# Altium project A13-OLinuXino-MICRO_Rev_B_saved.PrjPcb
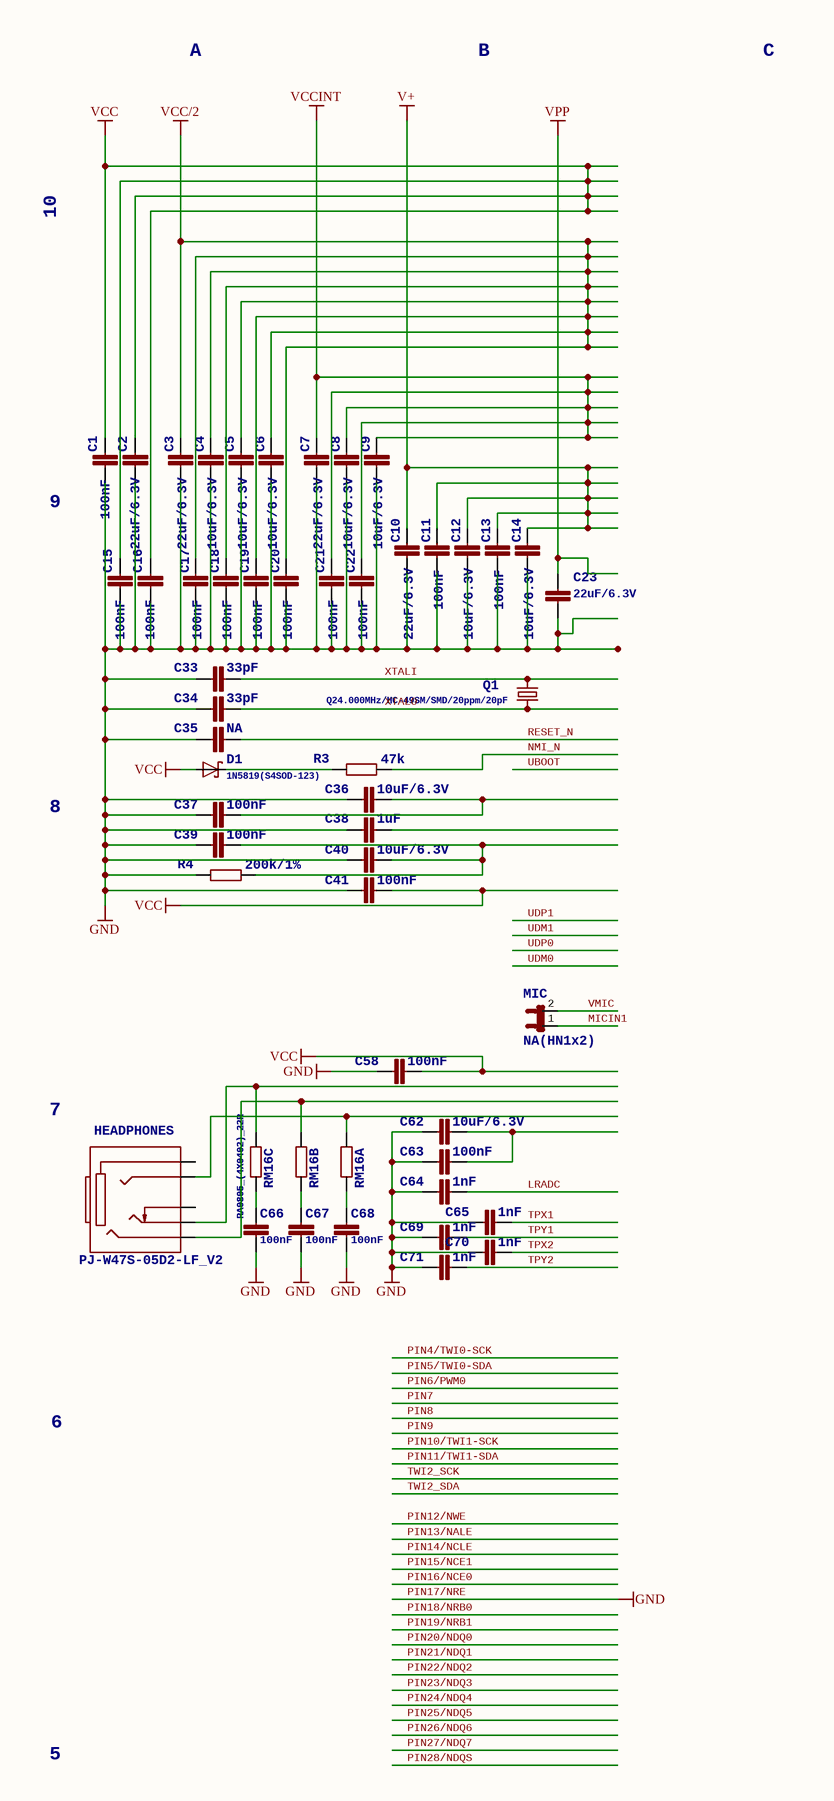
[diagram p0: A13-OLinuXino-MICRO_Rev_B_saved.SchDoc, top left]
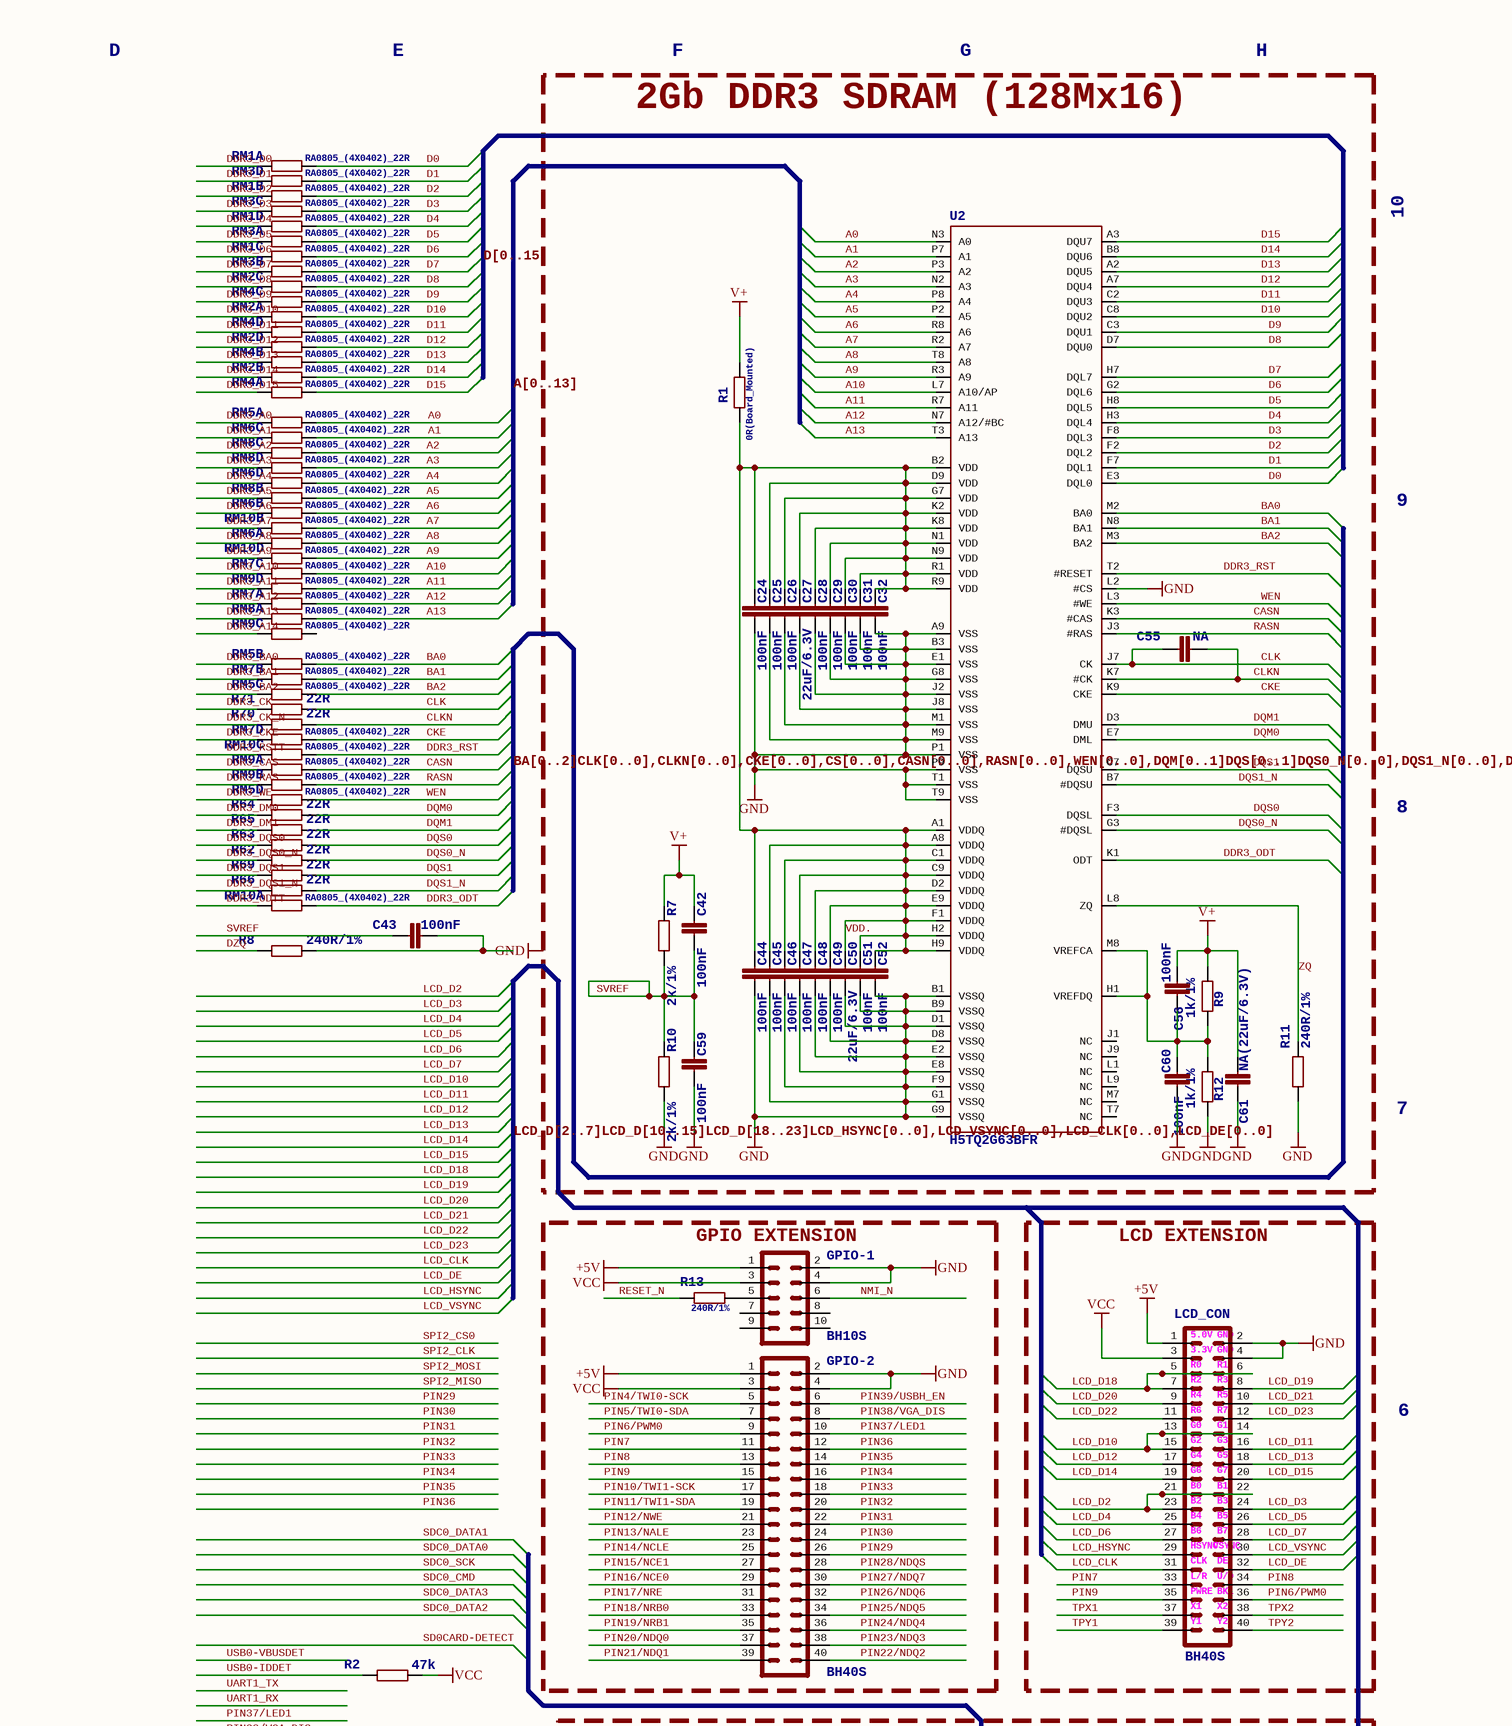
[diagram p1: A13-OLinuXino-MICRO_Rev_B_saved.SchDoc, top right]
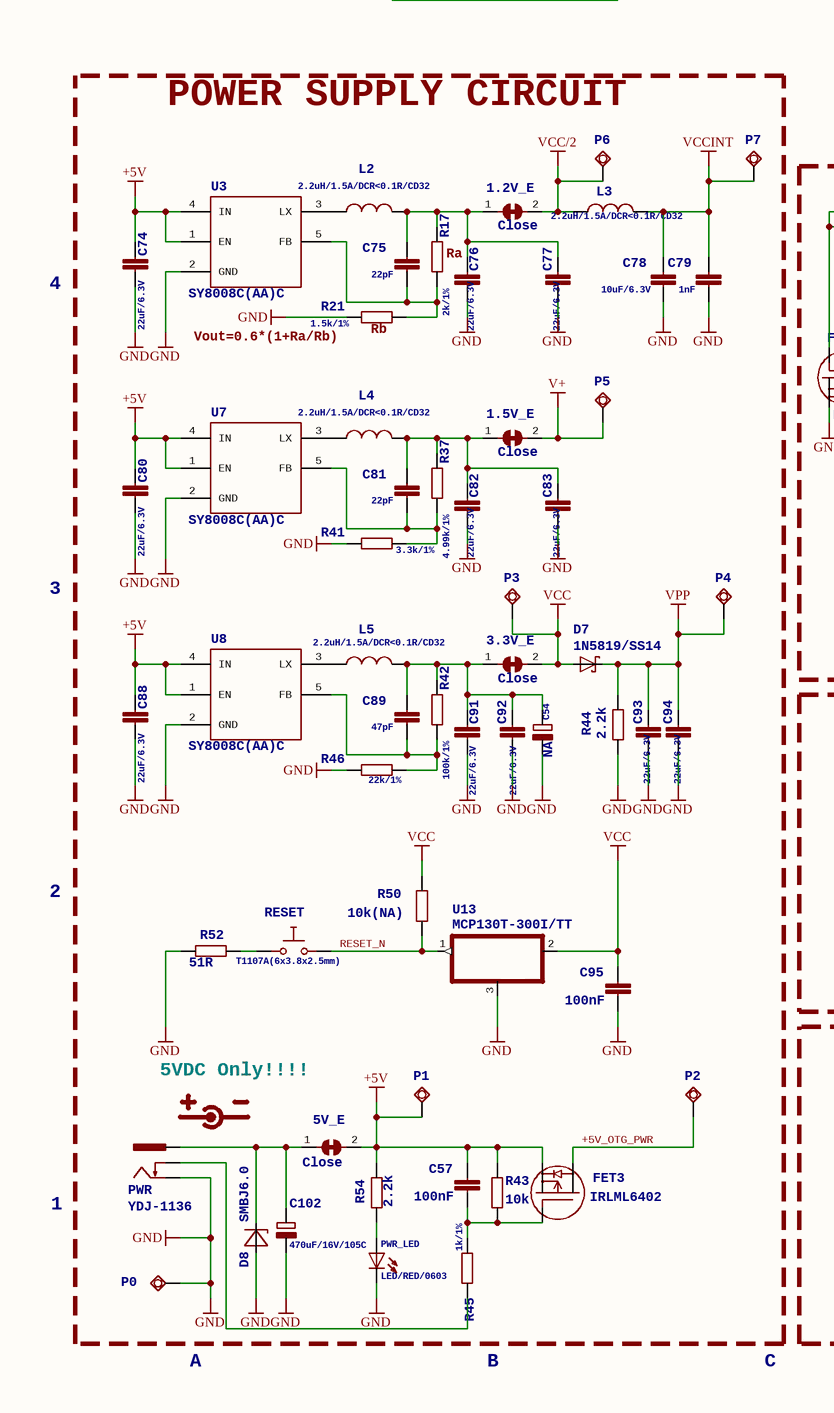
[diagram p2: A13-OLinuXino-MICRO_Rev_B_saved.SchDoc, bottom left]
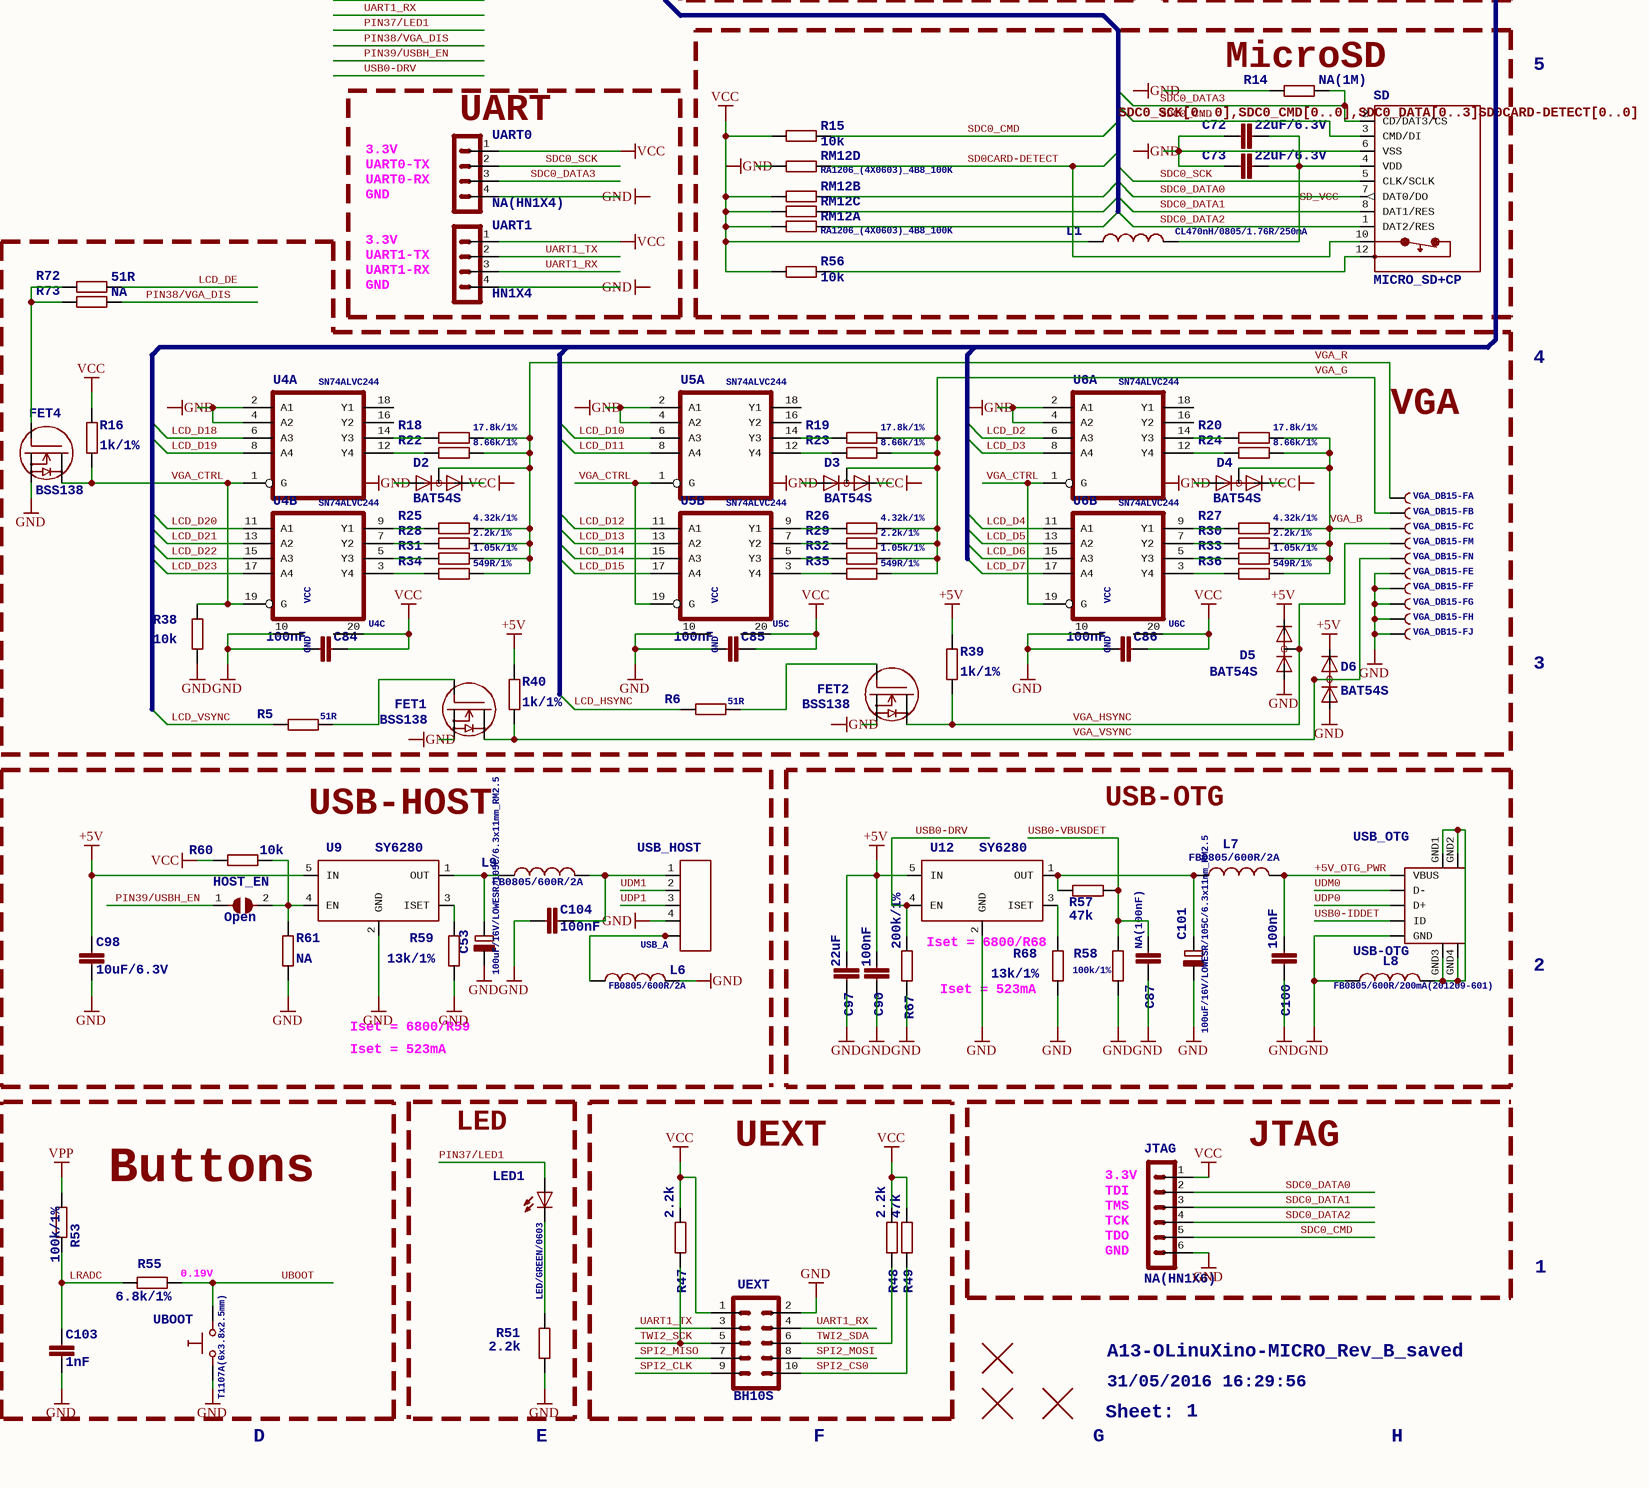
[diagram p3: A13-OLinuXino-MICRO_Rev_B_saved.SchDoc, bottom right]
1 sheet, 253 parts. Net scope: global (net labels, ports and power ports of the same name join across sheets).
Board file: A13-OLinuXino-MICRO_Rev_B_saved.PcbDoc

## Sheet A13-OLinuXino-MICRO_Rev_B_saved.SchDoc: A13-OLinuXino-MICRO_Rev_B_saved
size 409 x 542 mm; Date: 31/05/2016 16:29:56; SheetNumber: 1

### Parts
1.2V_E  Close  [SJ_1_SMALLER_CLOSE]
1.5V_E  Close  [SJ_1_SMALLER_CLOSE]
3.3V_E  Close  [SJ_1_SMALLER_CLOSE]
5V_E  Close  [SJ_1_SMALLER_CLOSE]
C1  100nF  [C0603_DWS]
C2  22uF/6.3V  [C0603_DWS]
C3  22uF/6.3V  [C0603_DWS]
C4  10uF/6.3V  [C0603_DWS]
C5  10uF/6.3V  [C0603_DWS]
C6  10uF/6.3V  [C0603_DWS]
C7  22uF/6.3V  [C0603_DWS]
C8  10uF/6.3V  [C0603_DWS]
C9  10uF/6.3V  [C0603_DWS]
C10  22uF/6.3V  [C0603_DWS]
C11  100nF  [C0603_DWS]
C12  10uF/6.3V  [C0603_DWS]
C13  100nF  [C0603_DWS]
C14  10uF/6.3V  [C0603_DWS]
C15  100nF  [C0603_DWS]
C16  100nF  [C0603_DWS]
C17  100nF  [C0603_DWS]
C18  100nF  [C0603_DWS]
C19  100nF  [C0603_DWS]
C20  100nF  [C0603_DWS]
C21  100nF  [C0603_DWS]
C22  100nF  [C0603_DWS]
C23  22uF/6.3V  [C0603_DWS]
C24  100nF  [C0603_DWS]
C25  100nF  [C0603_DWS]
C26  100nF  [C0603_DWS]
C27  22uF/6.3V  [C0603_DWS]
C28  100nF  [C0603_DWS]
C29  100nF  [C0603_DWS]
C30  100nF  [C0603_DWS]
C31  100nF  [C0603_DWS]
C32  100nF  [C0603_DWS]
C33  33pF  [C0603_DWS]
C34  33pF  [C0603_DWS]
C35  NA  [C0603_DWS]
C36  10uF/6.3V  [C0603_DWS]
C37  100nF  [C0603_DWS]
C38  1uF  [C0603_DWS]
C39  100nF  [C0603_DWS]
C40  10uF/6.3V  [C0603_DWS]
C41  100nF  [C0603_DWS]
C42  100nF  [C0603_DWS]
C43  100nF  [C0603_DWS]
C44  100nF  [C0603_DWS]
C45  100nF  [C0603_DWS]
C46  100nF  [C0603_DWS]
C47  100nF  [C0603_DWS]
C48  100nF  [C0603_DWS]
C49  100nF  [C0603_DWS]
C50  22uF/6.3V  [C0603_DWS]
C51  100nF  [C0603_DWS]
C52  100nF  [C0603_DWS]
C53  100uF/16V/LOWESR/105C/6.3x11mm_RM2.5  [E2,5-6,3]
C54  NA  [E3,5-8]
C55  NA  [C0603_DWS]
C56  100nF  [C0603_DWS]
C57  100nF  [C0603_DWS]
C58  100nF  [C0603_DWS]
C59  100nF  [C0603_DWS]
C60  100nF  [C0603_DWS]
C61  NA(22uF/6.3V)  [C0603_DWS]
C62  10uF/6.3V  [C0603_DWS]
C63  100nF  [C0603_DWS]
C64  1nF  [C0603_DWS]
C65  1nF  [C0603_DWS]
C66  100nF  [C0603_DWS]
C67  100nF  [C0603_DWS]
C68  100nF  [C0603_DWS]
C69  1nF  [C0603_DWS]
C70  1nF  [C0603_DWS]
C71  1nF  [C0603_DWS]
C72  22uF/6.3V  [C0603_DWS]
C73  22uF/6.3V  [C0603_DWS]
C74  22uF/6.3V  [C0603_DWS]
C75  22pF  [C0603_DWS]
C76  22uF/6.3V  [C0603_DWS]
C77  22uF/6.3V  [C0603_DWS]
C78  10uF/6.3V  [C0603_DWS]
C79  1nF  [C0603_DWS]
C80  22uF/6.3V  [C0603_DWS]
C81  22pF  [C0603_DWS]
C82  22uF/6.3V  [C0603_DWS]
C83  22uF/6.3V  [C0603_DWS]
C84  100nF  [C0603_DWS]
C85  100nF  [C0603_DWS]
C86  100nF  [C0603_DWS]
C87  NA(100nF)  [C0603_DWS]
C88  22uF/6.3V  [C0603_DWS]
C89  47pF  [C0603_DWS]
C90  100nF  [C0603_DWS]
C91  22uF/6.3V  [C0603_DWS]
C92  22uF/6.3V  [C0603_DWS]
C93  22uF/6.3V  [C0603_DWS]
C94  22uF/6.3V  [C0603_DWS]
C95  100nF  [C0603_DWS]
C97  22uF  [C0603_DWS]
C98  10uF/6.3V  [C0603_DWS]
C100  100nF  [C0603_DWS]
C101  100uF/16V/LOWESR/105C/6.3x11mm_RM2.5  [E2,5-6,3]
C102  470uF/16V/105C  [E3,5-8]
C103  1nF  [C0603_DWS]
C104  100nF  [C0603_DWS]
D1  1N5819(S4SOD-123)  [SOD-123]
D2  BAT54S  [SOT23C(BAT54S)]
D3  BAT54S  [SOT23C(BAT54S)]
D4  BAT54S  [SOT23C(BAT54S)]
D5  BAT54S  [SOT23C(BAT54S)]
D6  BAT54S  [SOT23C(BAT54S)]
D7  1N5819/SS14  [MLL-41]
D8  SMBJ6.0  [DO214AA]
FET1  BSS138  [SOT23]
FET2  BSS138  [SOT23]
FET3  IRLML6402  [SOT23]
FET4  BSS138  [SOT23]
GPIO-1  BH10S  [ML10-MALE]
GPIO-2  BH40S  [ML40]
HEADPHONES  PJ-W47S-05D2-LF_V2  [PJ-W47S-05D2-LF_5PIN_V2]
HOST_EN  Open  [SJ_1_SMALLER]
JTAG  NA(HN1X6)  [HN1X6]
L1  CL470nH/0805/1.76R/250mA  [L0805_5MIL_DWS]
L2  2.2uH/1.5A/DCR<0.1R/CD32  [CD32]
L3  2.2uH/1.5A/DCR<0.1R/CD32  [CD32]
L4  2.2uH/1.5A/DCR<0.1R/CD32  [CD32]
L5  2.2uH/1.5A/DCR<0.1R/CD32  [CD32]
L6  FB0805/600R/2A  [L0805_5MIL_DWS]
L7  FB0805/600R/2A  [L0805_5MIL_DWS]
L8  FB0805/600R/200mA(201209-601)  [L0805_5MIL_DWS]
L9  FB0805/600R/2A  [L0805_5MIL_DWS]
LCD_CON  BH40S  [ML40]
LED1  LED/GREEN/0603  [LED-0603]
MIC  NA(HN1x2)  [JP1]
P0  TESTPADTESTPAD_40-ROUND  [TESTPAD_40-ROUND]  (value not drawn)
P1  TESTPADTESTPAD_40-ROUND  [TESTPAD_40-ROUND]  (value not drawn)
P2  TESTPADTESTPAD_40-ROUND  [TESTPAD_40-ROUND]  (value not drawn)
P3  TESTPADTESTPAD_40-ROUND  [TESTPAD_40-ROUND]  (value not drawn)
P4  TESTPADTESTPAD_40-ROUND  [TESTPAD_40-ROUND]  (value not drawn)
P5  TESTPADTESTPAD_40-ROUND  [TESTPAD_40-ROUND]  (value not drawn)
P6  TESTPADTESTPAD_40-ROUND  [TESTPAD_40-ROUND]  (value not drawn)
P7  TESTPADTESTPAD_40-ROUND  [TESTPAD_40-ROUND]  (value not drawn)
PWR  YDJ-1136  [PWR_JACK_UNI_MILLING]
PWR_LED  LED/RED/0603  [LED-0603]
Q1  Q24.000MHz/HC-49SM/SMD/20ppm/20pF  [HC49/SMD2_THIN]
R1  0R(Board_Mounted)  [0603_0R]
R2  47k  [R0603_5MIL_DWS]
R3  47k  [R0603_5MIL_DWS]
R4  200k/1%  [R0603_5MIL_DWS]
R5  51R  [R0603_5MIL_DWS]
R6  51R  [R0603_5MIL_DWS]
R7  2k/1%  [R0603_5MIL_DWS]
R8  240R/1%  [R0603_5MIL_DWS]
R9  1k/1%  [R0603_5MIL_DWS]
R10  2k/1%  [R0603_5MIL_DWS]
R11  240R/1%  [R0603_5MIL_DWS]
R12  1k/1%  [R0603_5MIL_DWS]
R13  240R/1%  [R0603_5MIL_DWS]
R14  NA(1M)  [R0603_5MIL_DWS]
R15  10k  [R0603_5MIL_DWS]
R16  1k/1%  [R0603_5MIL_DWS]
R17  2k/1%  [R0603_5MIL_DWS]
R18  17.8k/1%  [R0603_5MIL_DWS]
R19  17.8k/1%  [R0603_5MIL_DWS]
R20  17.8k/1%  [R0603_5MIL_DWS]
R21  1.5k/1%  [R0603_5MIL_DWS]
R22  8.66k/1%  [R0603_5MIL_DWS]
R23  8.66k/1%  [R0603_5MIL_DWS]
R24  8.66k/1%  [R0603_5MIL_DWS]
R25  4.32k/1%  [R0603_5MIL_DWS]
R26  4.32k/1%  [R0603_5MIL_DWS]
R27  4.32k/1%  [R0603_5MIL_DWS]
R28  2.2k/1%  [R0603_5MIL_DWS]
R29  2.2k/1%  [R0603_5MIL_DWS]
R30  2.2k/1%  [R0603_5MIL_DWS]
R31  1.05k/1%  [R0603_5MIL_DWS]
R32  1.05k/1%  [R0603_5MIL_DWS]
R33  1.05k/1%  [R0603_5MIL_DWS]
R34  549R/1%  [R0603_5MIL_DWS]
R35  549R/1%  [R0603_5MIL_DWS]
R36  549R/1%  [R0603_5MIL_DWS]
R37  4.99k/1%  [R0603_5MIL_DWS]
R38  10k  [R0603_5MIL_DWS]
R39  1k/1%  [R0603_5MIL_DWS]
R40  1k/1%  [R0603_5MIL_DWS]
R41  3.3k/1%  [R0603_5MIL_DWS]
R42  100k/1%  [R0603_5MIL_DWS]
R43  10k  [R0603_5MIL_DWS]
R44  2.2k  [R0603_5MIL_DWS]
R45  1k/1%  [R0603_5MIL_DWS]
R46  22k/1%  [R0603_5MIL_DWS]
R47  2.2k  [R0603_5MIL_DWS]
R48  2.2k  [R0603_5MIL_DWS]
R49  47k  [R0603_5MIL_DWS]
R50  10k(NA)  [R0603_5MIL_DWS]
R51  2.2k  [R0603_5MIL_DWS]
R52  51R  [R0603_5MIL_DWS]
R53  100k/1%  [R0603_5MIL_DWS]
R54  2.2k  [R0603_5MIL_DWS]
R55  6.8k/1%  [R0603_5MIL_DWS]
R56  10k  [R0603_5MIL_DWS]
R57  47k  [R0603_5MIL_DWS]
R58  100k/1%  [R0603_5MIL_DWS]
R59  13k/1%  [R0603_5MIL_DWS]
R60  10k  [R0603_5MIL_DWS]
R61  NA  [R0603_5MIL_DWS]
R62  22R  [R0603_5MIL_DWS]
R63  22R  [R0603_5MIL_DWS]
R64  22R  [R0603_5MIL_DWS]
R65  22R  [R0603_5MIL_DWS]
R66  22R  [R0603_5MIL_DWS]
R67  200k/1%  [R0603_5MIL_DWS]
R68  13k/1%  [R0603_5MIL_DWS]
R69  22R  [R0603_5MIL_DWS]
R70  22R  [R0603_5MIL_DWS]
R71  22R  [R0603_5MIL_DWS]
R72  51R  [R0603_5MIL_DWS]
R73  NA  [R0603_5MIL_DWS]
RESET  T1107A(6x3.8x2.5mm)  [SW-TAKT_6X3.5_SMD]
RM1  RA0805_(4X0402)_22R  [R_MATRIX_4_0402_25X625]  (parts A,B,C,D of 4)
RM2  RA0805_(4X0402)_22R  [R_MATRIX_4_0402_25X625]  (parts A,B,C,D of 4)
RM3  RA0805_(4X0402)_22R  [R_MATRIX_4_0402_25X625]  (parts A,B,C,D of 4)
RM4  RA0805_(4X0402)_22R  [R_MATRIX_4_0402_25X625]  (parts A,B,C,D of 4)
RM5  RA0805_(4X0402)_22R  [R_MATRIX_4_0402_25X625]  (parts A,B,C,D of 4)
RM6  RA0805_(4X0402)_22R  [R_MATRIX_4_0402_25X625]  (parts A,B,C,D of 4)
RM7  RA0805_(4X0402)_22R  [R_MATRIX_4_0402_25X625]  (parts A,B,C,D of 4)
RM8  RA0805_(4X0402)_22R  [R_MATRIX_4_0402_25X625]  (parts A,B,C,D of 4)
RM9  RA0805_(4X0402)_22R  [R_MATRIX_4_0402_25X625]  (parts A,B,C,D of 4)
RM10  RA0805_(4X0402)_22R  [R_MATRIX_4_0402_25X625]  (parts A,B,C,D of 4)
RM12  RA1206_(4X0603)_4B8_100K  [R_MATRIX_4]  (value not drawn)  (parts A,B,C,D of 4)
RM16  RA0805_(4X0402)_22R  [R_MATRIX_4_0402_25X625]  (parts A,B,C of 4)
SD  MICRO_SD+CP  [TFR-MEM-CON]
U2  H5TQ2G63BFR  [FBGA96]
U3  SY8008C(AA)C  [SOT23-5]
U4  SN74ALVC244  [PW]  (parts A,B,C of 3)
U5  SN74ALVC244  [PW]  (parts A,B,C of 3)
U6  SN74ALVC244  [PW]  (parts A,B,C of 3)
U7  SY8008C(AA)C  [SOT23-5]
U8  SY8008C(AA)C  [SOT23-5]
U9  SY6280  [SOT23-5]
U12  SY6280  [SOT23-5]
U13  MCP130T-300I/TT  [SOT23]
U$1  FIDUCIAL1X2  [FIDUCIAL-1X2]  (value not drawn)
U$2  FIDUCIAL1X2  [FIDUCIAL-1X2]  (value not drawn)
U$3  FIDUCIAL1X2  [FIDUCIAL-1X2]  (value not drawn)
UART0  NA(HN1X4)  [HN1X4]
UART1  HN1X4  [HN1X4]
UBOOT  T1107A(6x3.8x2.5mm)  [SW-TAKT_6X3.5_SMD]
UEXT  BH10S  [ML10-MALE]
USB_HOST  USB_A  [USB_PN87520_HOST_PTH]
USB_OTG  USB-OTG  [USB_MINI_9PIN]
VGA_DB15-F  VGA15  [DB15-F_22MM]  (value not drawn)  (parts A,B,C,E,F,G,H,J,M,N of 17)

### Blocks framed on the sheet
2Gb DDR3 SDRAM (128Mx16): C24-C32 C42 C44-C52 C55 C56 C59-C61 R1 R7 R9-R12 U2
GPIO EXTENSION: GPIO-1 GPIO-2 R13
LCD EXTENSION: LCD_CON
UART: UART0 UART1
MicroSD: C72 C73 L1 R14 R15 R56 RM12 SD
POWER SUPPLY CIRCUIT: 1.2V_E 1.5V_E 3.3V_E 5V_E C54 C57 C74-C83 C88 C89 C91-C95 C102 D7 D8 FET3 L2-L5 P0-P7 PWR PWR_LED R17 R21 R37 R41-R46 R50 R52 R54 RESET U3 U7 U8 U13
VGA: C84-C86 D2-D6 FET1 FET2 FET4 R5 R6 R16 R18-R20 R22-R36 R38-R40 R72 R73 U4-U6 VGA_DB15-F
USB-HOST: C53 C98 C104 HOST_EN L6 L9 R59-R61 U9 USB_HOST
USB-OTG: C87 C90 C97 C100 C101 L7 L8 R57 R58 R67 R68 U12 USB_OTG
Buttons: C103 R53 R55 UBOOT
LED: LED1 R51
UEXT: R47-R49 UEXT
JTAG: JTAG

### Nets
+5V: 5V_E.2 C57.1 C74.1 C80.1 C88.1 C90.1 C97.1 C98.1 D5.2(K) D6.2(K) FET3.2(S) GPIO-1.1 GPIO-2.1 LCD_CON.1 P1.1(PP) R39.2 R40.2 R43.2 R54.1 U3.1(EN) U3.4(IN) U7.1(EN) U7.4(IN) U8.1(EN) U8.4(IN) U9.5(IN) U12.5(IN)
PIN17/NRE: 3.3V_E.2 C1.1 C1.2 C2.1 C2.2 C3.1 C4.1 C5.1 C6.1 C7.1 C8.1 C9.1 C10.1 C11.1 C12.1 C13.1 C14.1 C15.1 C15.2 C16.1 C16.2 C17.1 C18.1 C19.1 C20.1 C21.1 C22.1 C23.1 C24.2 C25.2 C26.2 C27.2 C28.2 C29.2 C30.2 C31.2 C32.2 C33.1 C34.1 C35.1 C36.1 C37.1 C38.1 C39.1 C40.1 C41.1 C41.2 C44.2 C45.2 C46.2 C47.2 C48.2 C49.2 C50.2 C51.2 C52.2 C53.- C54.- C58.1 C58.2 C59.1 C60.1 C61.1 C62.1 C63.1 C64.1 C65.1 C66.1 C67.1 C68.1 C69.1 C70.1 C71.1 C74.2 C76.2 C77.2 C78.2 C79.2 C80.2 C82.2 C83.2 C84.1 C84.2 C85.1 C85.2 C86.1 C86.2 C87.2 C88.2 C90.2 C91.2 C92.2 C93.2 C94.2 C95.1 C95.2 C97.2 C98.2 C100.2 C101.- C102.- C103.2 C104.2 D1.A D5.1(A) D6.1(A) D7.A D8.A FET4.2(S) GPIO-1.2 GPIO-1.3 GPIO-1.4 GPIO-2.2 GPIO-2.3 GPIO-2.4 GPIO-2.31 JTAG.1 JTAG.6 L1.1 L6.1 L8.1 LCD_CON.2 LCD_CON.3 LCD_CON.4 P0.1(PP) P3.1(PP) PWR.- PWR_LED.C R2.1 R4.2 R10.1 R11.1 R12.1 R15.2 R16.2 R21.2 R38.1 R41.2 R44.2 R46.2 R47.2 R48.2 R49.2 R50.2 R51.1 R52.2 R56.2 R58.1 R59.1 R60.1 R61.1 R67.1 R68.1 RM12.1.2 RM12.2.2 RM12.3.2 U2.A9(VSS) U2.B1(VSSQ) U2.B3(VSS) U2.B9(VSSQ) U2.D1(VSSQ) U2.D8(VSSQ) U2.E1(VSS) U2.E2(VSSQ) U2.E8(VSSQ) U2.F9(VSSQ) U2.G1(VSSQ) U2.G8(VSS) U2.G9(VSSQ) U2.J2(VSS) U2.J8(VSS) U2.L2(#CS) U2.M1(VSS) U2.M9(VSS) U2.P1(VSS) U2.P9(VSS) U2.T1(VSS) U2.T9(VSS) U3.2(GND) U4.10(GND) U4.20(VCC) U5.10(GND) U5.20(VCC) U6.10(GND) U6.20(VCC) U7.2(GND) U8.2(GND) U9.2(GND) U12.2(GND) U13.2(VCC) U13.3(GND) UART0.1 UART1.1 UBOOT.P$1 UEXT.1 UEXT.2 USB_HOST.4 USB_OTG.GND VGA_DB15-F.5(F) VGA_DB15-F.6(F) VGA_DB15-F.7(F) VGA_DB15-F.8(F) VGA_DB15-F.10(F)  [also labelled GND, VCC]
V+: 1.5V_E.2 C10.2 C11.2 C12.2 C13.2 C14.2 C42.1 C56.1 C61.2 P5.1(PP) R1.1(1.1) R7.2 R9.2
VCC/2: 1.2V_E.2 C3.2 C4.2 C5.2 C6.2 C17.2 C18.2 C19.2 C20.2 L3.1 P6.1(PP)
VCCINT: C7.2 C8.2 C9.2 C21.2 C22.2 C78.1 C79.1 L3.2 P7.1(PP)
VPP: C23.2 C93.1 C94.1 D7.K(C) P4.1(PP) R44.1 R53.1
+5V_OTG_PWR: C100.1 FET3.3(D) L7.1 P2.1(PP) USB_OTG.VBUS
A0: RM5.1.2 U2.N3(A0)
A1: RM6.3.2 U2.P7(A1)
A2: RM8.3.2 U2.P3(A2)
A3: RM8.4.2 U2.N2(A3)
A4: RM6.4.2 U2.P8(A4)
A5: RM8.2.2 U2.P2(A5)
A6: RM6.2.2 U2.R8(A6)
A7: RM10.2.2 U2.R2(A7)
A8: RM6.1.2 U2.T8(A8)
A9: RM10.4.2 U2.R3(A9)
A10: RM7.3.2 U2.L7(A10/AP)
A11: RM9.4.2 U2.R7(A11)
A12: RM7.1.2 U2.N7(A12/#BC)
A13: RM8.1.2 U2.T3(A13)
BA0: RM5.2.2 U2.M2(BA0)
BA1: RM7.2.2 U2.N8(BA1)
BA2: RM5.3.2 U2.M3(BA2)
BA[0..2]CLK[0..0],CLKN[0..0],CKE[0..0],CS[0..0],CASN[0..0],RASN[0..0],WEN[0..0],DQM[0..1]DQS[0..1]DQS0_N[0..0],DQS1_N[0..0],DDR3_RST[0..0],DDR3_ODT[0..0]: RM9.2.2 U2.J3(#RAS)  [also labelled RASN]
CASN: RM9.1.2 U2.K3(#CAS)
CKE: RM7.4.2 U2.K9(CKE)
CLK: C55.1 R71.1 U2.J7(CK)
CLKN: C55.2 R70.1 U2.K7(#CK)
D0: RM1.1.2 U2.E3(DQL0)
D1: RM3.4.2 U2.F7(DQL1)
D2: RM1.2.2 U2.F2(DQL2)
D3: RM3.3.2 U2.F8(DQL3)
D4: RM1.4.2 U2.H3(DQL4)
D5: RM3.1.2 U2.H8(DQL5)
D6: RM1.3.2 U2.G2(DQL6)
D7: RM3.2.2 U2.H7(DQL7)
D8: RM2.3.2 U2.D7(DQU0)
D9: RM4.3.2 U2.C3(DQU1)
D10: RM2.1.2 U2.C8(DQU2)
D11: RM4.4.2 U2.C2(DQU3)
D12: RM2.4.2 U2.A7(DQU4)
D13: RM4.2.2 U2.A2(DQU5)
D14: RM2.2.2 U2.B8(DQU6)
D15: RM4.1.2 U2.A3(DQU7)
DDR3_A0: RM5.1.1
DDR3_A1: RM6.3.1
DDR3_A2: RM8.3.1
DDR3_A3: RM8.4.1
DDR3_A4: RM6.4.1
DDR3_A5: RM8.2.1
DDR3_A6: RM6.2.1
DDR3_A7: RM10.2.1
DDR3_A8: RM6.1.1
DDR3_A9: RM10.4.1
DDR3_A10: RM7.3.1
DDR3_A11: RM9.4.1
DDR3_A12: RM7.1.1
DDR3_A13: RM8.1.1
DDR3_A14: RM9.3.1
DDR3_BA0: RM5.2.1
DDR3_BA1: RM7.2.1
DDR3_BA2: RM5.3.1
DDR3_CAS: RM9.1.1
DDR3_CK: R71.2
DDR3_CK_N: R70.2
DDR3_CKE: RM7.4.1
DDR3_D0: RM1.1.1
DDR3_D1: RM3.4.1
DDR3_D2: RM1.2.1
DDR3_D3: RM3.3.1
DDR3_D4: RM1.4.1
DDR3_D5: RM3.1.1
DDR3_D6: RM1.3.1
DDR3_D7: RM3.2.1
DDR3_D8: RM2.3.1
DDR3_D9: RM4.3.1
DDR3_D10: RM2.1.1
DDR3_D11: RM4.4.1
DDR3_D12: RM2.4.1
DDR3_D13: RM4.2.1
DDR3_D14: RM2.2.1
DDR3_D15: RM4.1.1
DDR3_DM0: R64.2
DDR3_DM1: R65.2
DDR3_DQS0: R63.2
DDR3_DQS0_N: R62.2
DDR3_DQS1: R69.2
DDR3_DQS1_N: R66.2
DDR3_ODT: RM10.1.2 U2.K1(ODT)
DDR3_ODTT: RM10.1.1
DDR3_RAS: RM9.2.1
DDR3_RST: RM10.3.2 U2.T2(#RESET)
DDR3_RSTT: RM10.3.1
DDR3_WE: RM5.4.1
DQM0: R64.1 U2.E7(DML)
DQM1: R65.1 U2.D3(DMU)
DQS0: R63.1 U2.F3(DQSL)
DQS0_N: R62.1 U2.G3(#DQSL)
DQS1: R69.1 U2.C7(DQSU)
DQS1_N: R66.1 U2.B7(#DQSU)
DZQ: R8.2
LCD_CLK: LCD_CON.31
LCD_D2: LCD_CON.21 LCD_CON.22 LCD_CON.23 U6.6(A3)
LCD_D3: LCD_CON.24 U6.8(A4)
LCD_D4: LCD_CON.25 U6.11(A1)
LCD_D5: LCD_CON.26 U6.13(A2)
LCD_D6: LCD_CON.27 U6.15(A3)
LCD_D7: LCD_CON.28 U6.17(A4)
LCD_D10: LCD_CON.13 LCD_CON.14 LCD_CON.15 U5.6(A3)
LCD_D11: LCD_CON.16 U5.8(A4)
LCD_D12: LCD_CON.17 U5.11(A1)
LCD_D13: LCD_CON.18 U5.13(A2)
LCD_D14: LCD_CON.19 U5.15(A3)
LCD_D15: LCD_CON.20 U5.17(A4)
LCD_D18: LCD_CON.5 LCD_CON.6 LCD_CON.7 U4.6(A3)
LCD_D19: LCD_CON.8 U4.8(A4)
LCD_D20: LCD_CON.9 U4.11(A1)
LCD_D21: LCD_CON.10 U4.13(A2)
LCD_D22: LCD_CON.11 U4.15(A3)
LCD_D23: LCD_CON.12 U4.17(A4)
LCD_DE: LCD_CON.32 R72.2
LCD_HSYNC: LCD_CON.29 R6.1
LCD_VSYNC: LCD_CON.30 R5.1
LRADC: C64.2 C103.1 R53.2 R55.1
MICIN1: MIC.1
NMI_N: GPIO-1.6 R3.1
PIN4/TWI0-SCK: GPIO-2.5
PIN5/TWI0-SDA: GPIO-2.7
PIN6/PWM0: GPIO-2.9 LCD_CON.36
PIN7: GPIO-2.11 LCD_CON.33
PIN8: GPIO-2.13 LCD_CON.34
PIN9: GPIO-2.15 LCD_CON.35
PIN10/TWI1-SCK: GPIO-2.17
PIN11/TWI1-SDA: GPIO-2.19
PIN12/NWE: GPIO-2.21
PIN13/NALE: GPIO-2.23
PIN14/NCLE: GPIO-2.25
PIN15/NCE1: GPIO-2.27
PIN16/NCE0: GPIO-2.29
PIN18/NRB0: GPIO-2.33
PIN19/NRB1: GPIO-2.35
PIN20/NDQ0: GPIO-2.37
PIN21/NDQ1: GPIO-2.39
PIN22/NDQ2: GPIO-2.40
PIN23/NDQ3: GPIO-2.38
PIN24/NDQ4: GPIO-2.36
PIN25/NDQ5: GPIO-2.34
PIN26/NDQ6: GPIO-2.32
PIN27/NDQ7: GPIO-2.30
PIN28/NDQS: GPIO-2.28
PIN29: GPIO-2.26
PIN30: GPIO-2.24
PIN31: GPIO-2.22
PIN32: GPIO-2.20
PIN33: GPIO-2.18
PIN34: GPIO-2.16
PIN35: GPIO-2.14
PIN36: GPIO-2.12
PIN37/LED1: GPIO-2.10 LED1.A
PIN38/VGA_DIS: GPIO-2.8 R73.2
PIN39/USBH_EN: GPIO-2.6 HOST_EN.1
RESET_N: C35.2 R13.1 R50.1 RESET.P$2 U13.1(RESET)
SD0CARD-DETECT: RM12.4.2 SD.10(CP_E)
SD_VCC: C72.2 C73.2 L1.2 SD.4(VDD)
SDC0_CMD: JTAG.5 R15.1 SD.3(CMD/DI)  [also labelled SDC0_SCK[0..0],SDC0_CMD[0..0],SDC0_DATA[0..3]SD0CARD-DETECT[0..0]]
SDC0_DATA0: JTAG.2 RM12.2.1 SD.7(DAT0/DO)
SDC0_DATA1: JTAG.3 RM12.3.1 SD.8(DAT1/RES)
SDC0_DATA2: JTAG.4 RM12.1.1 SD.1(DAT2/RES)
SDC0_DATA3: R14.1 SD.2(CD/DAT3/CS) UART0.3
SDC0_SCK: SD.5(CLK/SCLK) UART0.2
SPI2_CLK: UEXT.9
SPI2_CS0: R49.1 UEXT.10
SPI2_MISO: UEXT.7
SPI2_MOSI: UEXT.8
SVREF: C42.2 C43.2 C59.2 R7.1 R10.2
TPX1: C65.2 LCD_CON.37
TPX2: C70.2 LCD_CON.38
TPY1: C69.2 LCD_CON.39
TPY2: C71.2 LCD_CON.40
TWI2_SCK: R47.1 UEXT.5
TWI2_SDA: R48.1 UEXT.6
UART1_RX: UART1.3 UEXT.4
UART1_TX: UART1.2 UEXT.3
UBOOT: R55.2 UBOOT.P$2
UDM0: USB_OTG.D-
UDM1: USB_HOST.2
UDP0: USB_OTG.D+
UDP1: USB_HOST.3
USB0-DRV: R67.2 U12.4(EN)
USB0-IDDET: R2.2 USB_OTG.ID
USB0-VBUSDET: C87.1 R57.1 R58.2
VDD.: C24.1 C25.1 C26.1 C27.1 C28.1 C29.1 C30.1 C31.1 C32.1 C44.1 C45.1 C46.1 C47.1 C48.1 C49.1 C50.1 C51.1 C52.1 R1.2(1.2) U2.A1(VDDQ) U2.A8(VDDQ) U2.B2(VDD) U2.C1(VDDQ) U2.C9(VDDQ) U2.D2(VDDQ) U2.D9(VDD) U2.E9(VDDQ) U2.F1(VDDQ) U2.G7(VDD) U2.H2(VDDQ) U2.H9(VDDQ) U2.K2(VDD) U2.K8(VDD) U2.N1(VDD) U2.N9(VDD) U2.R1(VDD) U2.R9(VDD)
VGA_B: D4.3(AK) R20.2 R24.2 R27.2 R30.2 R33.2 R36.2 VGA_DB15-F.3(F)
VGA_CTRL: FET4.3(D) R16.1 R38.2 U4.1(G) U4.19(G) U5.1(G) U5.19(G) U6.1(G) U6.19(G)
VGA_G: D3.3(AK) R19.2 R23.2 R26.2 R29.2 R32.2 R35.2 VGA_DB15-F.2(F)
VGA_HSYNC: D5.3(AK) FET2.3(D) R39.1 VGA_DB15-F.13(F)
VGA_R: D2.3(AK) R18.2 R22.2 R25.2 R28.2 R31.2 R34.2 VGA_DB15-F.1(F)
VGA_VSYNC: D6.3(AK) FET1.3(D) R40.1 VGA_DB15-F.14(F)
VMIC: MIC.2
WEN: RM5.4.2 U2.L3(#WE)
XTALI: C33.2 Q1.2
XTALO: C34.2 Q1.1
ZQ: R11.2 U2.L8(ZQ)
Net1.2V_E_1: 1.2V_E.1 C75.1 C76.1 C77.1 L2.2 R17.1
Net1.5V_E_1: 1.5V_E.1 C81.1 C82.1 C83.1 L4.2 R37.1
Net3.3V_E_1: 3.3V_E.1 C54.+ C89.1 C91.1 C92.1 L5.2 R42.1
Net5V_E_1: 5V_E.1 C102.+ D8.C PWR.+
NetC36_2: C36.2 C37.2
NetC39_2: C39.2 C40.2 R4.1
NetC43_1: C43.1 R8.1
NetC53_+: C53.+ L9.1 U9.1(OUT)
NetC56_2: C56.2 C60.2 R9.1 R12.2 U2.H1(VREFDQ) U2.M8(VREFCA)
NetC57_2: C57.2 FET3.1(G) R43.1 R45.2
NetC62_2: C62.2 C63.2
NetC66_2: C66.2 RM16.3.1
NetC67_2: C67.2 RM16.2.1
NetC68_2: C68.2 RM16.1.1
NetC72_1: C72.1 C73.1 SD.6(VSS)
NetC75_2: C75.2 R17.2 R21.1 U3.5(FB)
NetC81_2: C81.2 R37.2 R41.1 U7.5(FB)
NetC89_2: C89.2 R42.2 R46.1 U8.5(FB)
NetC101_+: C101.+ L7.2 R57.2 U12.1(OUT)
NetC104_1: C104.1 L9.2 USB_HOST.1
NetD1_C: D1.C R3.2
NetFET1_1: FET1.1(G) R5.2
NetFET2_1: FET2.1(G) R6.2
NetFET4_1: FET4.1(G) R72.1 R73.1
NetGPIO-1_5: GPIO-1.5 R13.2
NetHEADPHONES_2: HEADPHONES.2 RM16.3.2
NetHEADPHONES_3: HEADPHONES.3 RM16.1.2
NetHEADPHONES_5: HEADPHONES.5 RM16.2.2
NetHOST_EN_2: HOST_EN.2 R60.2 R61.2 U9.4(EN)
NetL2_1: L2.1 U3.3(LX)
NetL4_1: L4.1 U7.3(LX)
NetL5_1: L5.1 U8.3(LX)
NetL6_2: L6.2 USB_HOST.P$1 USB_HOST.P$2
NetL8_2: L8.2 USB_OTG.GND1 USB_OTG.GND2 USB_OTG.GND3 USB_OTG.GND4
NetLED1_C: LED1.C R51.2
NetPWR_--: PWR.-- R45.1
NetPWR_LED_A: PWR_LED.A R54.2
NetR18_1: R18.1 U4.14(Y3)
NetR19_1: R19.1 U5.14(Y3)
NetR20_1: R20.1 U6.14(Y3)
NetR22_1: R22.1 U4.12(Y4)
NetR23_1: R23.1 U5.12(Y4)
NetR24_1: R24.1 U6.12(Y4)
NetR25_1: R25.1 U4.9(Y1)
NetR26_1: R26.1 U5.9(Y1)
NetR27_1: R27.1 U6.9(Y1)
NetR28_1: R28.1 U4.7(Y2)
NetR29_1: R29.1 U5.7(Y2)
NetR30_1: R30.1 U6.7(Y2)
NetR31_1: R31.1 U4.5(Y3)
NetR32_1: R32.1 U5.5(Y3)
NetR33_1: R33.1 U6.5(Y3)
NetR34_1: R34.1 U4.3(Y4)
NetR35_1: R35.1 U5.3(Y4)
NetR36_1: R36.1 U6.3(Y4)
NetR52_1: R52.1 RESET.P$1
NetR56_1: R56.1 SD.12(PACK)
NetR59_2: R59.2 U9.3(ISET)
NetR68_2: R68.2 U12.3(ISET)
NetU4_2: U4.2(A1) U4.4(A2)
NetU5_2: U5.2(A1) U5.4(A2)
NetU6_2: U6.2(A1) U6.4(A2)

Not connected (* = marked no-connect by the designer): C38 2; D2 1(A) 2(K); D3 1(A) 2(K); D4 1(A) 2(K); FET1 2(S); FET2 2(S); GPIO-1 7 8 9 10; HEADPHONES 1 4; R14 2; RM9 3.2(2); RM12 4.1(1); U2 J1(NC) J9(NC) L1(NC) L9(NC) M7(NC) T7(NC); U4 16(Y2) 18(Y1); U5 16(Y2) 18(Y1); U6 16(Y2) 18(Y1); UART0 4; UART1 4

### Buses and harness runs
bus A[0..13]
bus D[0..15]
bus LCD_D[2..7]LCD_D[10..15]LCD_D[18..23]LCD_HSYNC[0..0],LCD_VSYNC[0..0],LCD_CLK[0..0],LCD_DE[0..0]

### Notes on the sheet
- A
- B
- C
- D
- E
- F
- G
- H
- 10
- 9
- 8
- 7
- (near LCD_CON) 5.0V
- (near LCD_CON) GND
- (near LCD_CON) R0
- (near LCD_CON) R2
- (near LCD_CON) R4
- (near LCD_CON) R6
- (near LCD_CON) 3.3V
- (near LCD_CON) R1
- (near LCD_CON) R3
- (near LCD_CON) R5
- (near LCD_CON) R7
- 6
- (near LCD_CON) G0
- (near LCD_CON) G2
- (near LCD_CON) G4
- (near LCD_CON) G6
- (near LCD_CON) B0
- (near LCD_CON) G1
- (near LCD_CON) G3
- (near LCD_CON) G5
- (near LCD_CON) G7
- (near LCD_CON) B1
- (near LCD_CON) B2
- (near LCD_CON) B4
- (near LCD_CON) B6
- (near LCD_CON) HSYNC
- (near LCD_CON) CLK
- (near LCD_CON) VSYNC
- (near LCD_CON) B3
- (near LCD_CON) B5
- (near LCD_CON) B7
- (near LCD_CON) DE
- (near LCD_CON) PWRE
- (near LCD_CON) X1
- (near LCD_CON) Y1
- (near LCD_CON) L/R
- (near LCD_CON) BKL
- (near LCD_CON) X2
- (near LCD_CON) Y2
- (near LCD_CON) U/D
- 5
- (near UART0) UART0-TX
- UART0-RX
- 3.3V
- GND
- UART1-TX
- Ra
- (near UART1) UART1-RX
- 4
- (near R21) Rb
- Vout=0.6*(1+Ra/Rb)
- 3
- 2
- Iset = 6800/R68
- Iset = 523mA
- Iset = 6800/R59
- 5VDC Only!!!!
- (near JTAG) 3.3V
- (near JTAG) TDI
- (near JTAG) TMS
- (near JTAG) TCK
- (near JTAG) TDO
- 1
- (near R55) 0.19V
- (near JTAG) GND
- A13-OLinuXino-MICRO_Rev_B_saved
- (near U$3) 31/05/2016 16:29:56
- (near U$3) G
- (near U$3) Sheet:
- Labels drawn without touching a wire or pin: GND, VCC

### Library data of the parts
1.2V_E 1.5V_E 3.3V_E 5V_E = SJSJ_1_SMALLER_CLOSE: SMD solder JUMPER
C1-C52 C55-C95 C97 C98 C100 C103 C104 = C-EUC0603_DWS: CAPACITOR, European symbol
C53 C101 = CPOL-EUE2.5-6.3: POLARIZED CAPACITOR, European symbol
C54 C102 = CPOL-EUE3.5-8: POLARIZED CAPACITOR, European symbol
D1 = SCHOTKKY7.62SS-1N5819(S4SOD-123)
D2-D6 = DIODE_AC-AC_: DUAL DIODE
D7 = SCHOTKKY7.62SS2
D8 = SMBJ16A
FET1 FET2 FET4 = N-MOS+DIODBSS138(SOT23-3)
FET3 = P-MOS+DIODIRLML6402
GPIO-1 UEXT = ML10: HARTING
GPIO-2 LCD_CON = ML40: HARTING
HEADPHONES = AUDIO_JACK_5PINPJ-W47S-05D2-LF_V2
HOST_EN = SJSJ_SMALLER: SMD solder JUMPER
JTAG = CON6HN1X6: CONNECTORS - 6 PINS
L1 L6-L9 = L-USL0805_5MIL_DWS: INDUCTOR, American symbol
L2-L5 = L-CD32
LED1 PWR_LED = LED0603DWS
MIC = JP1E: JUMPER
P0-P7 = TESTPADTESTPAD_40-ROUND: drill 40mils, diameter 70mils
PWR = PWR-JAKPWR_JACK_UNI_MILLING
Q1 = HC49/S1: CRYSTAL
R1 = R_0R0R(NA)
R2-R73 = R-EU_R0603_5MIL_DWS: RESISTOR, European symbol
RESET UBOOT = SW-TAKT6
RM1-RM10 RM16 = R_MATRIX_4E_25X625
RM12 = R_MATRIX_4E
SD = MICRO_SD/MMC_CPMICRO
U3 U7 U8 = SY8008
U4-U6 = 74ALVC244
U13 = RESETMCP130T-300-I/TT: Microcontroller Supervisory Circuit   with Open Drain Output
U$1-U$3 = FIDUCIAL1X2: Fiducial Alignment PointsVarious fiducial points for machine vision alignment.
UART0 UART1 = CON4HN1X4
USB_HOST = USB_SHIELD3
USB_OTG = MINI_USB9
VGA_DB15-F = DB1522